# EAGLE design 16276 (EAGLE 7.6.0)
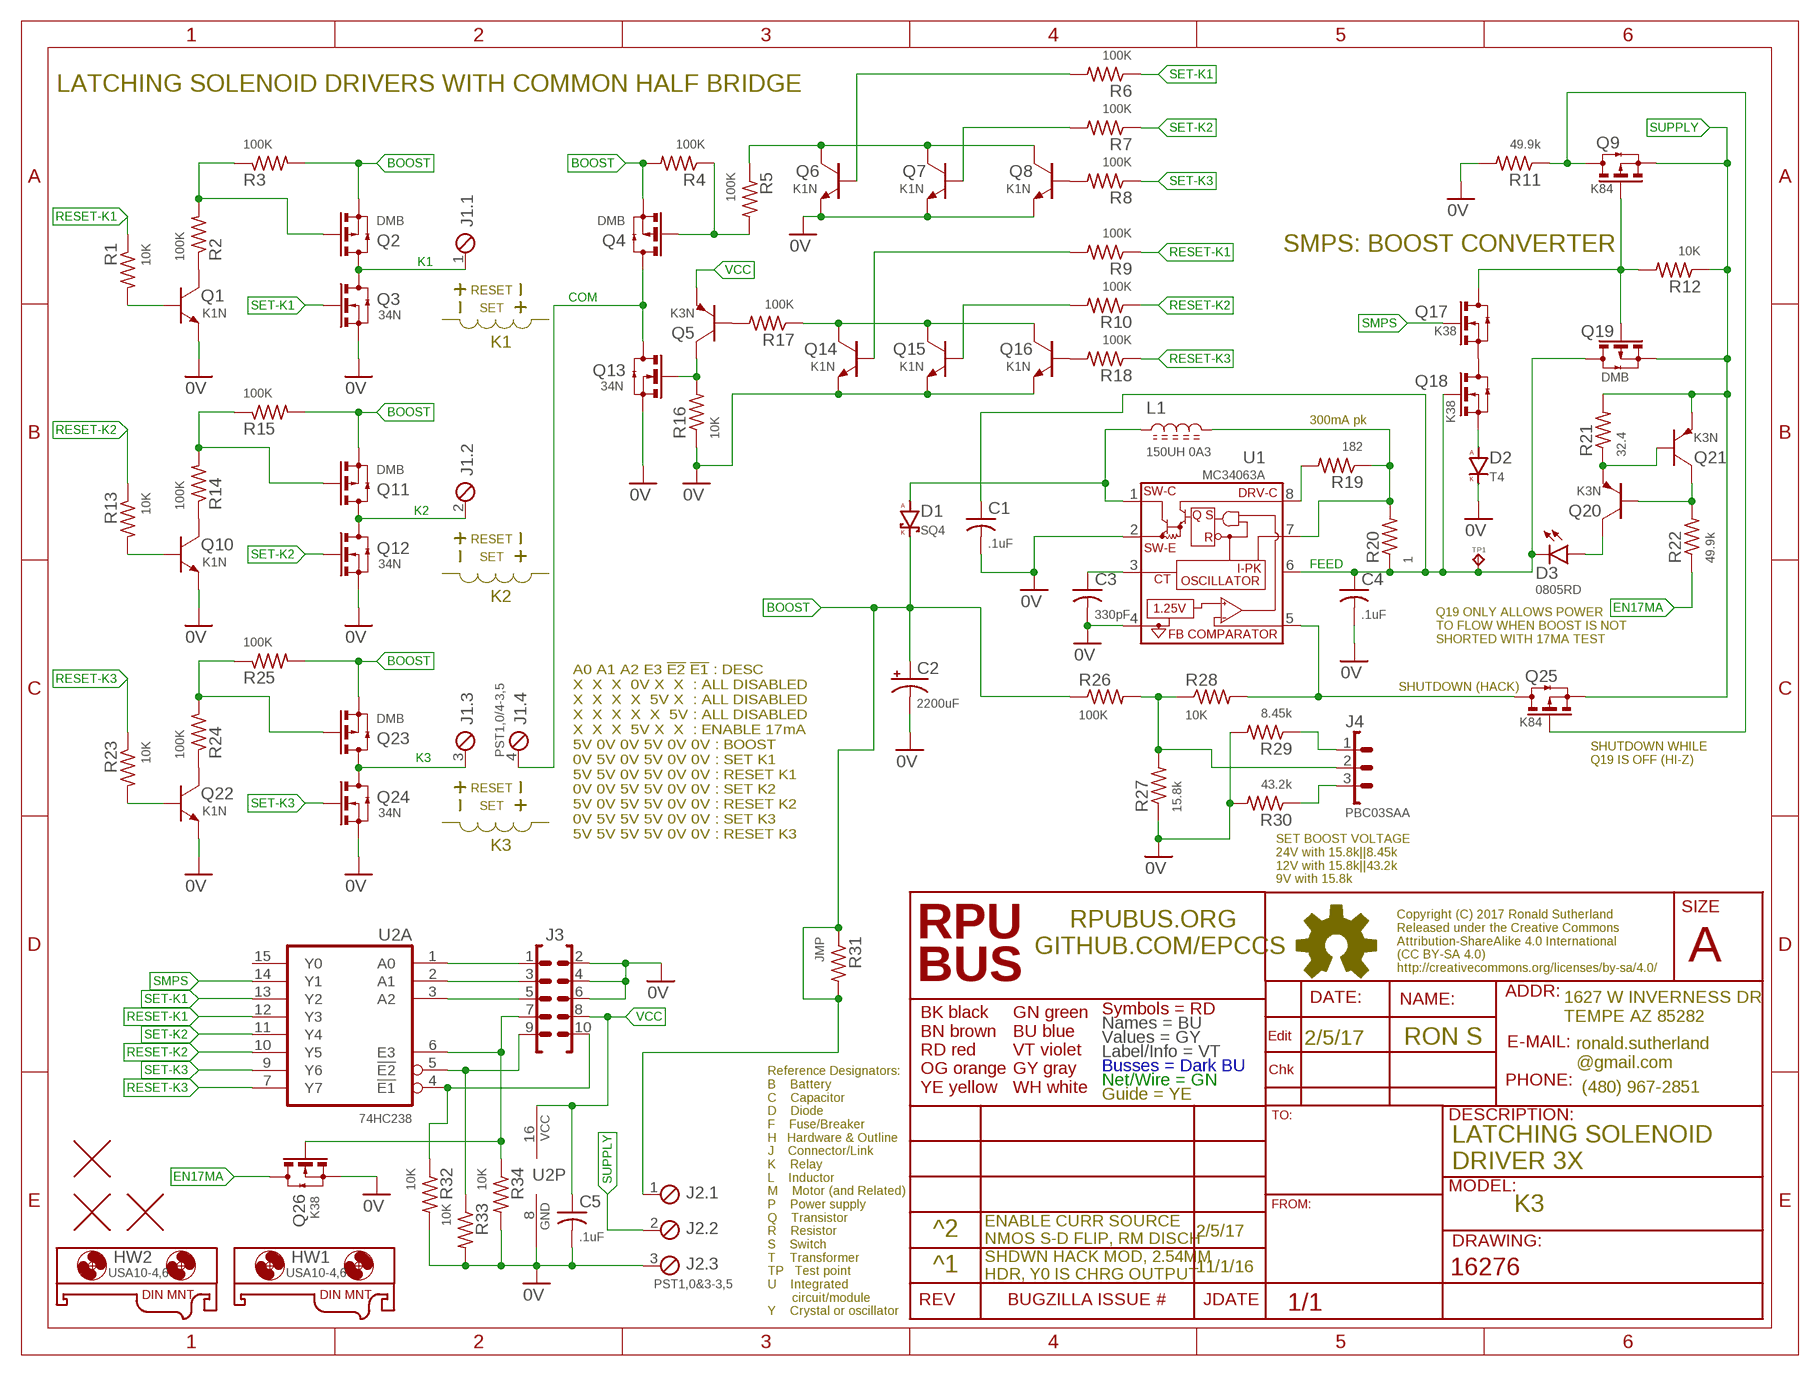
[diagram p0: schematic, sheet 1]

## Parts
C1  .1uF  CC0603A  [C0603(1608)]
C2  2200uF  C-AL7.5X18  [E7,5-18]
C3  330pF  CC0603A  [C0603(1608)]
C4  .1uF  CC0603A  [C0603(1608)]
C5  .1uF  CC0603A  [C0603(1608)]
D1  SQ4  DSMA  [SMA]
D2  T4  DSOD123  [SOD123]
D3  0805RD  LEDC0805(2012)  [C0805(2012)]
HW1  USA10-4,6  MOUNT-HOLE5.0  [USA10]
HW2  USA10-4,6  MOUNT-HOLE5.0  [USA10]
J1  PST1,0/4-3,5  MCV4  [MCV4]
J2  PST1,0&3-3,5  MCV3  [MCV3]
J3  2X5  [2X5]
J4  PBC03SAA  1X3  [1X3]
L1  150UH 0A3  L2626  [L2626]
Q1  K1N  NPNSOT23  [SOT23]
Q2  DMB  N-CHSOT23  [SOT23]
Q3  34N  N-CHSOT23  [SOT23]
Q4  DMB  N-CHSOT23  [SOT23]
Q5  K3N  PNPSOT23  [SOT23]
Q6  K1N  NPNSOT23  [SOT23]
Q7  K1N  NPNSOT23  [SOT23]
Q8  K1N  NPNSOT23  [SOT23]
Q9  K84  N-CHSOT23  [SOT23]
Q10  K1N  NPNSOT23  [SOT23]
Q11  DMB  N-CHSOT23  [SOT23]
Q12  34N  N-CHSOT23  [SOT23]
Q13  34N  N-CHSOT23  [SOT23]
Q14  K1N  NPNSOT23  [SOT23]
Q15  K1N  NPNSOT23  [SOT23]
Q16  K1N  NPNSOT23  [SOT23]
Q17  K38  N-CHSOT23  [SOT23]
Q18  K38  N-CHSOT23  [SOT23]
Q19  DMB  N-CHSOT23  [SOT23]
Q20  K3N  PNPSOT23  [SOT23]
Q21  K3N  PNPSOT23  [SOT23]
Q22  K1N  NPNSOT23  [SOT23]
Q23  DMB  N-CHSOT23  [SOT23]
Q24  34N  N-CHSOT23  [SOT23]
Q25  K84  N-CHSOT23  [SOT23]
Q26  K38  N-CHSOT23  [SOT23]
R1  10K  R0805  [C0805(2012)]
R2  100K  R0805  [C0805(2012)]
R3  100K  R0805  [C0805(2012)]
R4  100K  R0805  [C0805(2012)]
R5  100K  R0805  [C0805(2012)]
R6  100K  R0805  [C0805(2012)]
R7  100K  R0805  [C0805(2012)]
R8  100K  R0805  [C0805(2012)]
R9  100K  R0805  [C0805(2012)]
R10  100K  R0805  [C0805(2012)]
R11  49.9k  R0805  [C0805(2012)]
R12  10K  R0805  [C0805(2012)]
R13  10K  R0805  [C0805(2012)]
R14  100K  R0805  [C0805(2012)]
R15  100K  R0805  [C0805(2012)]
R16  10K  R0805  [C0805(2012)]
R17  100K  R0805  [C0805(2012)]
R18  100K  R0805  [C0805(2012)]
R19  182  R0805  [C0805(2012)]
R20  1  R1210  [C1210(3225)]
R21  32.4  R0805  [C0805(2012)]
R22  49.9k  R0805  [C0805(2012)]
R23  10K  R0805  [C0805(2012)]
R24  100K  R0805  [C0805(2012)]
R25  100K  R0805  [C0805(2012)]
R26  100K  R0805  [C0805(2012)]
R27  15.8k  R0805  [C0805(2012)]
R28  10K  R0805  [C0805(2012)]
R29  8.45k  R0805  [C0805(2012)]
R30  43.2k  R0805  [C0805(2012)]
R31  JMP  R0805  [C0805(2012)]
R32  10K  R0805  [C0805(2012)]
R33  10K  R0805  [C0805(2012)]
R34  10K  R0805  [C0805(2012)]
TP1  TPPAD1-08  [P1-08]
U1  MC34063A  [SOIC8]
U2  74HC238  74238D  [16SOIC]
U$2  FIDUCIAL1.27  [FIDUCIAL-1.27]
U$3  FIDUCIAL1.27  [FIDUCIAL-1.27]
U$4  FIDUCIAL1.27  [FIDUCIAL-1.27]

## Nets
0V: C1.2 C2.- C3.2 C4.2 C5.2 D2.C(K) J2.3 J3.2 J3.4 J3.6 Q1.E Q3.2(S)(S) Q6.E Q7.E Q8.E Q10.E Q12.2(S)(S) Q13.2(S)(S) Q14.E Q15.E Q16.E Q22.E Q24.2(S)(S) Q26.2(S)(S) R11.2 R16.1 R27.1 R29.2 R30.2 R32.2 R33.2 R34.2 U1.2(SW-E) U1.4(GND) U2.8(P:GND)
!E1: J3.10 R32.1 U2.4(A:!E1)
!E2: J3.9 R33.1 U2.5(A:!E2)
A0: J3.1 U2.1(A:A0)
A1: J3.3 U2.2(A:A1)
A2: J3.5 U2.3(A:A2)
BOOST: C2.+ D1.K J2.1 Q2.2(S)(S) Q4.2(S)(S) Q11.2(S)(S) Q23.2(S)(S) R3.2 R4.2 R15.2 R25.2 R26.1 R31.1 R31.2
COM: J1.4 Q4.3(D)(D) Q13.3(D)(D)
E3: J3.7 Q26.1(G)(G) R34.1 U2.6(A:E3)
EN17MA: Q26.3(D)(D) R22.1
FEED: C1.1 C4.1 D3.K Q18.1(G)(G) Q19.3(D)(D) R20.1 TP1.TP U1.6(VCC)
K1: J1.1 Q2.3(D)(D) Q3.3(D)(D)
K2: J1.2 Q11.3(D)(D) Q12.3(D)(D)
K3: J1.3 Q23.3(D)(D) Q24.3(D)(D)
N$2: Q9.3(D)(D) Q25.1(G)(G) R11.1
N$3: Q23.1(G)(G) R24.2 R25.1
N$4: Q22.C R24.1
N$5: Q22.B R23.2
N$6: Q17.2(S)(S) Q18.3(D)(D)
N$7: Q25.3(D)(D) R28.2 U1.5(FB)
N$8: D2.A Q18.2(S)(S)
N$9: Q4.1(G)(G) R4.1 R5.2
N$13: R19.2 U1.8(DRV-C)
N$14: L1.2 R19.1 R20.2 U1.7(I-PK)
N$15: D1.A L1.1 U1.1(SW-C)
N$16: C3.1 U1.3(CT)
N$21: Q5.C Q13.1(G)(G) R16.2
N$22: Q9.1(G)(G) Q17.3(D)(D) Q19.1(G)(G) R12.2
N$26: J4.2 R26.2 R27.2 R28.1
N$27: Q6.C Q7.C Q8.C R5.1
N$28: Q6.B R6.2
N$33: Q8.B R8.2
N$35: Q2.1(G)(G) R2.2 R3.1
N$36: Q1.C R2.1
N$37: Q1.B R1.2
N$43: Q11.1(G)(G) R14.2 R15.1
N$44: Q10.C R14.1
N$45: Q10.B R13.2
N$71: Q7.B R7.2
N$72: Q5.B R17.2
N$73: Q14.C Q15.C Q16.C R17.1
N$79: Q14.B R9.2
N$81: Q15.B R10.2
N$86: D3.A Q20.C
N$87: Q16.B R18.2
N$120: J4.3 R30.1
N$121: J4.1 R29.1
N$128: Q20.E Q21.B R21.1
N$132: Q20.B Q21.C R22.2
RESET-K1: R1.1 R9.1 U2.12(A:Y3)
RESET-K2: R10.1 R13.1 U2.10(A:Y5)
RESET-K3: R18.1 R23.1 U2.7(A:Y7)
SET-K1: Q3.1(G)(G) R6.1 U2.13(A:Y2)
SET-K2: Q12.1(G)(G) R7.1 U2.11(A:Y4)
SET-K3: Q24.1(G)(G) R8.1 U2.9(A:Y6)
SMPS: Q17.1(G)(G) U2.14(A:Y1)
SUPPLY: J2.2 Q9.2(S)(S) Q19.2(S)(S) Q21.E Q25.2(S)(S) R12.1 R21.2
VCC: C5.1 J3.8 Q5.E U2.16(P:VCC)
Unconnected: U2.15(A:Y0)

## Notes on the sheet
- LATCHING SOLENOID DRIVERS WITH COMMON HALF BRIDGE
- SMPS: BOOST CONVERTER
- RESET
- SET
- K1
- 300mA pk
- RESET
- SET
- K2
- Q19 ONLY ALLOWS POWER 
  TO FLOW WHEN BOOST IS NOT
  SHORTED WITH 17MA TEST
- SHUTDOWN (HACK)
- SHUTDOWN WHILE
  Q19 IS OFF (HI-Z)
- RESET
- SET
- A0 A1 A2 E3 !E2! !E1! : DESC
   X  X  X  0V X  X  : ALL DISABLED
   X  X  X  X  5V X  : ALL DISABLED
   X  X  X  X  X  5V : ALL DISABLED
   X  X  X  5V X  X  : ENABLE 17mA
   5V 0V 0V 5V 0V 0V : BOOST
   0V 5V 0V 5V 0V 0V : SET K1
   5V 5V 0V 5V 0V 0V : RESET K1
   0V 0V 5V 5V 0V 0V : SET K2
   5V 0V 5V 5V 0V 0V : RESET K2
   0V 5V 5V 5V 0V 0V : SET K3
   5V 5V 5V 5V 0V 0V : RESET K3
- K3
- SET BOOST VOLTAGE
  24V with 15.8k||8.45k
  12V with 15.8k||43.2k
  9V with 15.8k
- 2/5/17 | RON S
- LATCHING SOLENOID
  DRIVER 3X
- K3
- ^2 | 2/5/17
- ENABLE CURR SOURCE
  NMOS S-D FLIP, RM DISCH
- ^1 | 11/1/16
- SHDWN HACK MOD, 2.54MM 
  HDR, Y0 IS CHRG OUTPUT

## Library data of the parts
C1 C3-C5 = C-C:C: CAPACITOR Symbol
C2 = C-Al:C-AL: Aluminum Electrolytic Capacitors PW1J222 [NICHICON,UPW1J222MHD] CAP ALUM 63V 2200UF 20% RADIAL
D1 = D-SBR:D: DIODE
D2 = D-GP:D: DIODE
D3 = D-LED:LED: LED 120120WH [CREE,XHGAWT-00-0000-00000HXE1] LED WHITE 6500K 150LUM-W120120
HW1 HW2 = HW-DINMnt:MOUNT-HOLE: USA10-4.6 [PhxCont,1202713] DINRAIL ADAPTER UNIVERSAL 10MM 4.6MM
J1 = J-HDR3.5mm:MCV4: MCV 1,5/4-G-3,5-RN [PHOENIX CONTACT,1843622] CONN HEADER SHROUDED 2POS 3.5MM PST 1,0/4-3,5 [PHOENIX CONTACT,1945119] CONN HEADER STRIP PIN 4POS 3.5MM MCVR 1,5& 4-ST-3,5 [PHOENIX CONTACT,1863178] CONN PLUG 4POS SCREW 3.5MM
J2 = J-HDR3.5mm:MCV3: MCV 1,5/ 3-G-3,5-RN [PHOENIX CONTACT,1731484] CONN HEADER SHROUDED 3POS 3.5MM MCVR 1,5/ 3-ST-3,5 [PHOENIX CONTACT,1863165] CONN PLUG 3POS SCREW 3.5MM PST 1,0/3-3,5 [PHOENIX CONTACT,1945106] CONN HEADER STRIP PIN 3POS 3.5MM PT1,5&3-PVH-3,5 [PHOENIX CONTACT,1984028] CONN PLUG STRIP 3POS 3.5MM
J3 = J-HDR2.54mm:2X5: 2 X 5 POS HEADER
J4 = J-HDR2.54mm:1X3: 6 POS HEADER PBC03SAAN [SULLINS,PBC03SAAN]HEADER MALE BRKWAY 3POS .1IN AA
L1 = L-PWR:L: Inductor
Q1 Q6-Q8 Q10 Q14-Q16 Q22 = Q-NPN:NPN: BJT NPN General Purpose Amplifier
Q2 Q4 Q9 Q11 Q19 Q23 Q25 = Q-PCH:N-CH?*: ENHANCEMENT MODE MOSFET SOT23 is BSS138 pinout
Q3 Q12 Q13 Q17 Q18 Q24 Q26 = Q-NCH:N-CH?*: ENHANCEMENT MODE MOSFET SOT23 is BSS138 pinout
Q5 Q20 Q21 = Q-PNP:PNP: BJT NPN General Purpose Amplifier
R1-R34 = R-C:R: Resiistor American-style symbol
TP1 = J-TP:TP: Test pad
U1 = U-Boost:MC34063A
U2 = U-7400:74*238: non-Inverting Logic 3- to 8-Line Decoder/Demultiplexer see 74138 for Inverting
U$2-U$4 = H-Fiducial:FIDUCIAL: Fiducial Alignment Points Various fiducial points for machine vision alignment.

## Net classes
0 default: width 0.254 mm, drill 0.33 mm

## Board
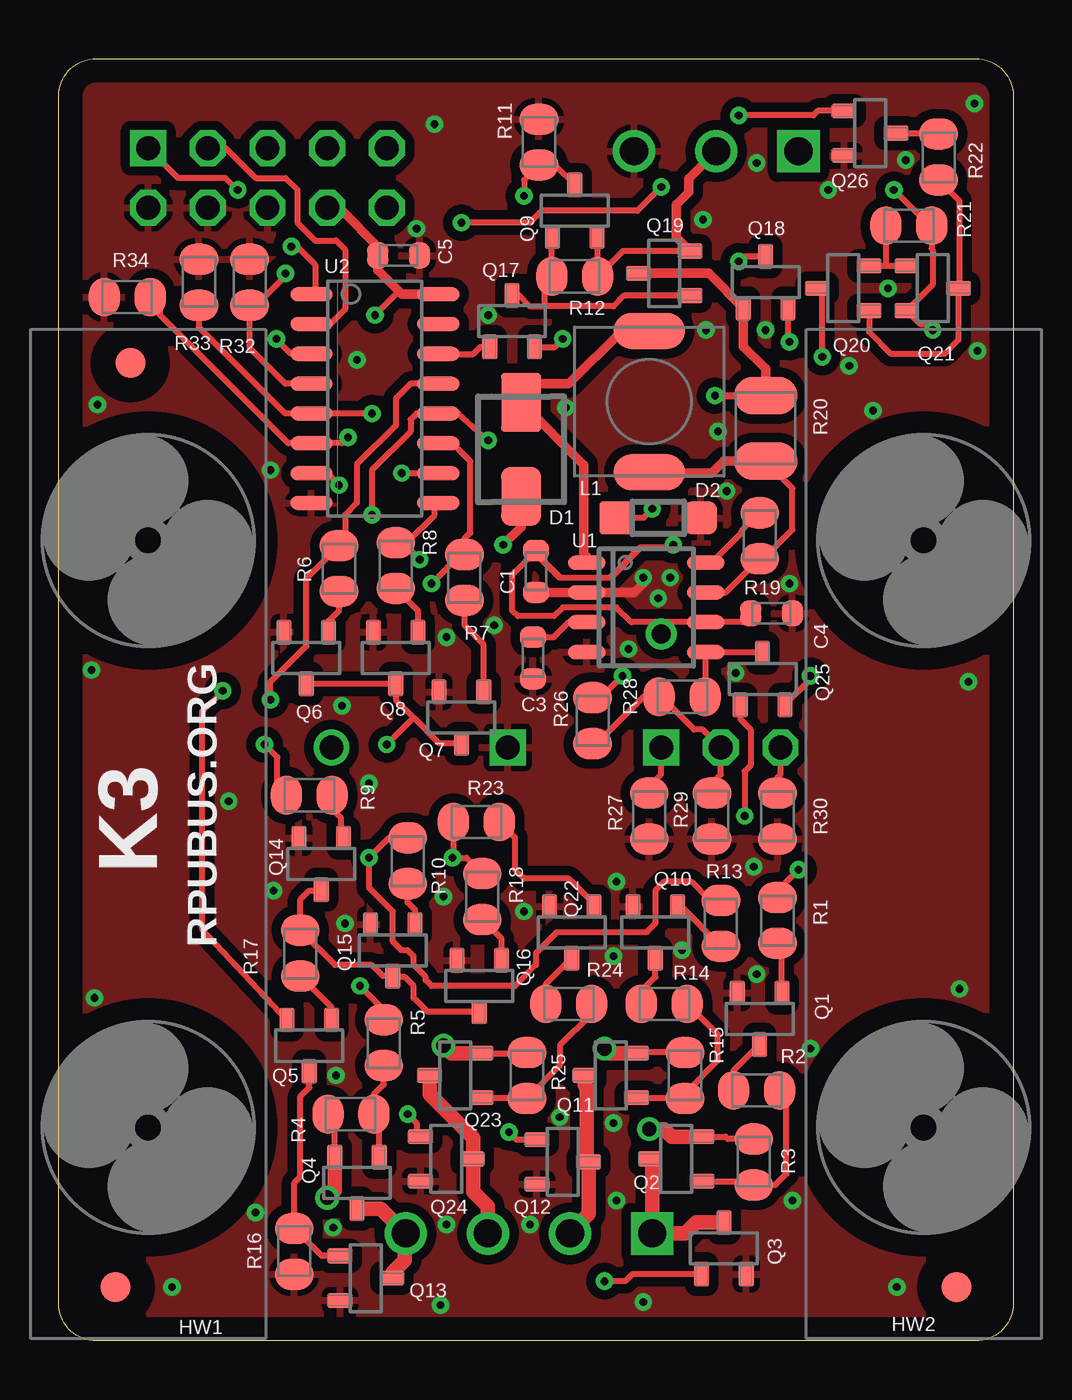
[diagram p1: board, top side]
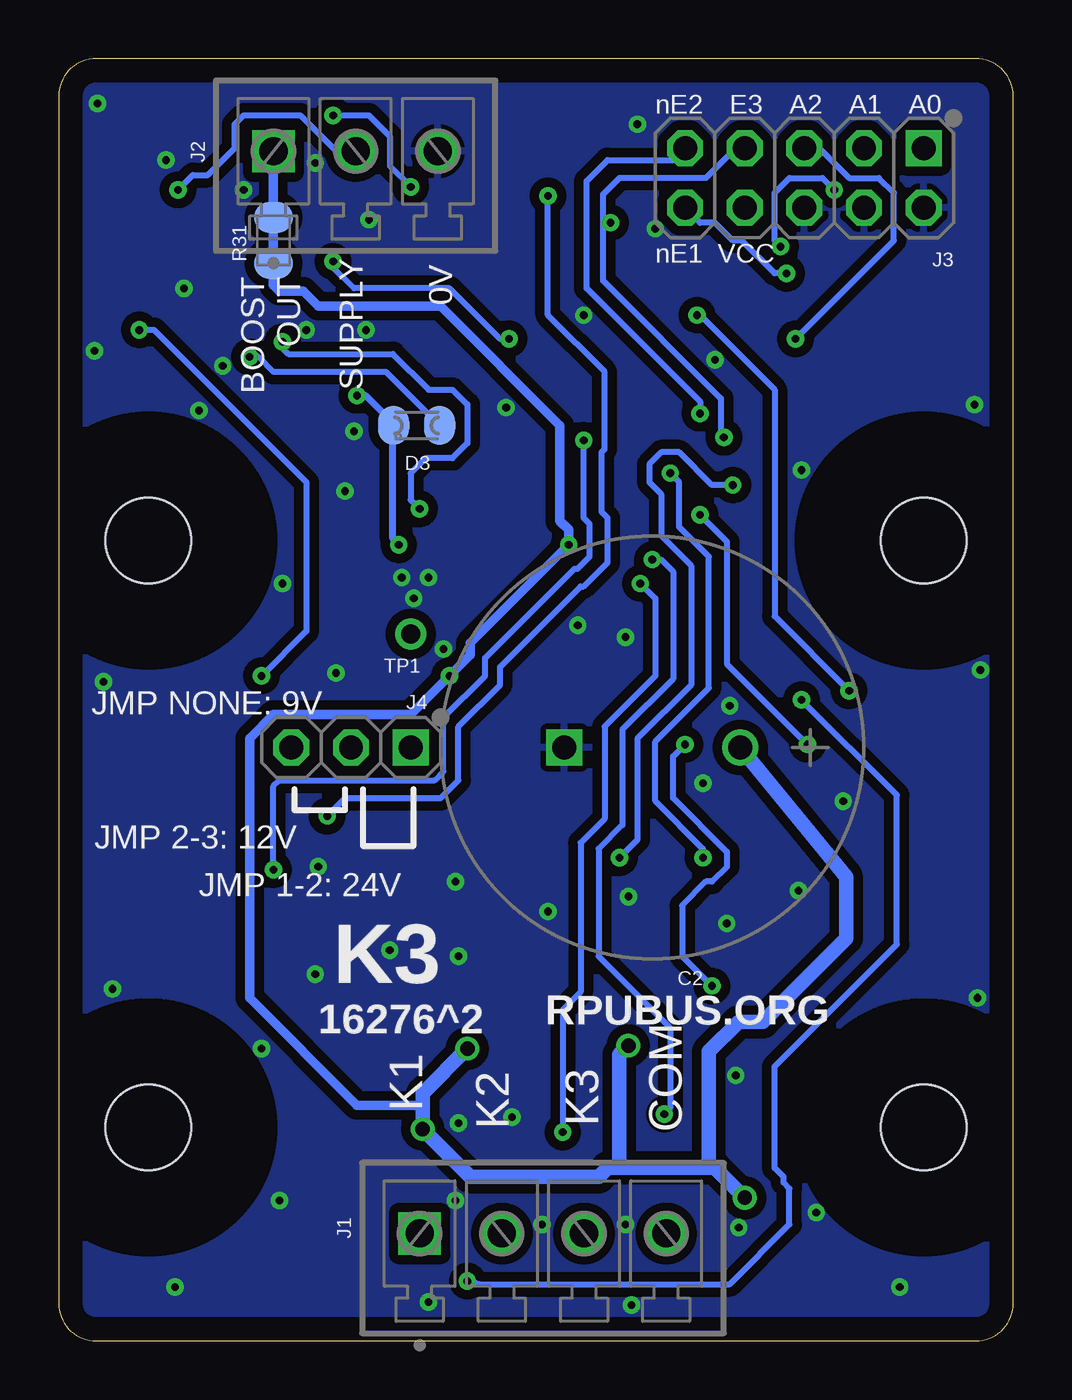
[diagram p2: board, bottom side, seen from below]

Size 40.64 x 54.61 mm. Coordinates in mm from the lower left corner, seen from the top.
Outline: 40.64,53.02 40.64,1.59 arc-90 39.05,0 1.59,0 arc-90 0,1.59 0,53.02 arc-90 1.59,54.61 39.05,54.61 arc-90 40.64,53.02
Copper layers (1*16): Top 0.034290625mm / dielectric 60mil / Bottom 0.034290625mm
Design rules "default *": minimum track width 10mil, minimum drill 13mil, track to track 12mil, track to pad 10mil, pad to pad 8mil, via to via 12mil, smd to smd 8mil, copper to edge 40mil, drill to drill 16mil, minimum pad ring 10mil, minimum via ring 8mil, stop-mask expansion 4mil, vias tented up to drill 17mil, thermal gap 10mil

### Footprints (pad centres in the part's own frame; a part is rotated, then mirrored left to right if it is on the bottom)
C0603(1608) = smd 0.898 x 1.1: 1 -0.889,0; 2 0.889,0
E7,5-18 = drill 1.016: + -3.75,0 | drill 1.016 square: - 3.75,0
SMA = smd 2.5 x 1.7: A 2,0; K -2,0
SOD123 = smd 1.4 x 1.4: A 1.8,0; C -1.8,0
C0805(2012) = smd 1.321 x 1.651: A 0.977,0; K -0.977,0
USA10 = hole 3.658: -12.5,0; 12.5,0
MCV4 = drill 1.2 square: 1 0,0 | drill 1.2: 2 3.5,0; 3 7,0; 4 10.5,0
MCV3 = drill 1.2 square: 1 0,0 | drill 1.2: 2 3.5,0; 3 7,0
2X5 = drill 1.016 square: 1 0,0 | drill 1.016 octagon: 2 0,2.54; 3 2.54,0; 4 2.54,2.54; 5 5.08,0; 6 5.08,2.54; 7 7.62,0; 8 7.62,2.54; 9 10.16,0; 10 10.16,2.54
1X3 = drill 1.016 square: 1 0,0 | drill 1.016 octagon: 2 2.54,0; 3 5.08,0
L2626 = smd 1.524 x 3.048: 1 3.01,0; 2 -3.01,0
SOT23 = smd 0.65 x 1.06: B -0.95,-1.1; C 0,1.1; E 0.95,-1.1
SOT23' = smd 0.65 x 1.06: 1(G) -0.95,-1.1; 2(S) 0.95,-1.1; 3(D) 0,1.1
C0805(2012)' = smd 1.321 x 1.651: 1 -0.977,0; 2 0.977,0
C1210(3225) = smd 1.6 x 2.7: 1 -1.4,0; 2 1.4,0
P1-08 = drill 0.813: TP 0,0
SOIC8 = smd 0.6 x 1.6: 1 -1.905,-2.54; 2 -0.635,-2.54; 3 0.635,-2.54; 4 1.905,-2.54; 5 1.905,2.54; 6 0.635,2.54; 7 -0.635,2.54; 8 -1.905,2.54
16SOIC = smd 0.6 x 1.8: 1 -4.445,-2.7; 2 -3.175,-2.7; 3 -1.905,-2.7; 4 -0.635,-2.7; 5 0.635,-2.7; 6 1.905,-2.7; 7 3.175,-2.7; 8 4.445,-2.7; 9 4.445,2.7; 10 3.175,2.7; 11 1.905,2.7; 12 0.635,2.7; 13 -0.635,2.7; 14 -1.905,2.7; 15 -3.175,2.7; 16 -4.445,2.7
FIDUCIAL-1.27 = smd 1.27 x 1.27: 1 0,0

### Placement (x,y rotation side)
C1  20.32,32.77 270 top
C2  15.37,25.27 180 bottom
C3  20.19,29.08 270 top
C4  30.35,30.99 0 top
C5  14.48,46.23 0 top
D1  19.68,37.97 90 top
D2  25.53,35.05 180 top
D3  25.4,38.99 0 bottom
HW1  3.81,21.59 90 top
HW2  36.83,21.59 90 top
J1  25.27,4.57 0 bottom
J2  31.5,50.67 0 bottom
J3  3.81,50.8 180 bottom
J4  25.65,25.27 180 bottom
L1  25.15,40.01 90 top
Q1  29.84,13.72 180 top
Q2  DMB  [SOT23']  26.29,7.75 90 top
Q3  34N  [SOT23']  28.32,3.94 0 top
Q4  DMB  [SOT23']  12.7,6.73 180 top
Q5  10.67,12.57 180 top
Q6  10.54,29.08 180 top
Q7  17.14,26.54 180 top
Q8  14.35,29.08 180 top
Q9  K84  [SOT23']  21.97,48.13 0 top
Q10  25.4,17.4 180 top
Q11  DMB  [SOT23']  23.5,11.3 90 top
Q12  34N  [SOT23']  21.46,7.62 270 top
Q13  34N  [SOT23']  13.08,2.67 270 top
Q14  11.18,20.32 180 top
Q15  14.22,16.64 180 top
Q16  17.91,15.11 180 top
Q17  K38  [SOT23']  19.3,43.43 0 top
Q18  K38  [SOT23']  30.1,45.09 0 top
Q19  DMB  [SOT23']  25.78,45.47 90 top
Q20  33.4,44.83 90 top
Q21  37.21,44.83 270 top
Q22  21.84,17.4 180 top
Q23  DMB  [SOT23']  16.89,11.3 90 top
Q24  34N  [SOT23']  16.51,7.75 270 top
Q25  K84  [SOT23']  29.97,28.19 0 top
Q26  K38  [SOT23']  34.54,51.44 270 top
R1  10K  [C0805(2012)']  30.61,17.91 270 top
R2  100K  [C0805(2012)']  29.72,10.67 0 top
R3  100K  [C0805(2012)']  29.59,7.62 90 top
R4  100K  [C0805(2012)']  12.45,9.65 180 top
R5  100K  [C0805(2012)']  13.84,12.7 270 top
R6  100K  [C0805(2012)']  11.94,32.89 270 top
R7  100K  [C0805(2012)']  17.27,32.51 270 top
R8  100K  [C0805(2012)']  14.35,33.02 270 top
R9  100K  [C0805(2012)']  10.67,23.24 0 top
R10  100K  [C0805(2012)']  14.86,20.45 270 top
R11  49.9k  [C0805(2012)']  20.45,51.05 90 top
R12  10K  [C0805(2012)']  21.97,45.34 180 top
R13  10K  [C0805(2012)']  28.19,17.78 270 top
R14  100K  [C0805(2012)']  25.78,14.35 0 top
R15  100K  [C0805(2012)']  26.67,11.3 90 top
R16  10K  [C0805(2012)']  10.03,3.81 90 top
R17  100K  [C0805(2012)']  10.29,16.51 270 top
R18  100K  [C0805(2012)']  18.03,18.92 270 top
R19  182  [C0805(2012)']  29.84,34.29 90 top
R20  30.1,38.86 270 top
R21  32.4  [C0805(2012)']  36.2,47.5 0 top
R22  49.9k  [C0805(2012)']  37.47,50.42 270 top
R23  10K  [C0805(2012)']  17.78,22.1 0 top
R24  100K  [C0805(2012)']  21.72,14.35 0 top
R25  100K  [C0805(2012)']  19.94,11.3 90 top
R26  100K  [C0805(2012)']  22.73,26.42 270 top
R27  15.8k  [C0805(2012)']  27.81,22.35 90 top
R28  10K  [C0805(2012)']  26.54,27.43 0 top
R29  8.45k  [C0805(2012)']  25.15,22.35 270 top
R30  43.2k  [C0805(2012)']  30.61,22.35 270 top
R31  JMP  [C0805(2012)']  31.5,46.86 90 bottom
R32  10K  [C0805(2012)']  8.13,45.09 90 top
R33  10K  [C0805(2012)']  5.97,45.09 90 top
R34  10K  [C0805(2012)']  2.92,44.45 180 top
TP1  25.65,30.1 0 bottom
U1  25.02,31.24 270 top
U2  13.46,40.13 270 top
U$2  38.23,2.29 0 top
U$3  3.05,41.66 0 top
U$4  2.41,2.29 0 top

### Tracks (layer width: path | path; a pad name or v marks a point on that pad's centre or on a via)
0V  (via drill 0.33)
  Top 0.406: C1.2 U1.2 24.51,31.88 24.89,32.26
  other vias: 24.89,32.51 26.04,32.51 25.53,31.62 28.45,36.2 24.26,29.46 23.75,19.56 31.11,32.26 34.67,39.62 39.12,42.16 38.99,52.7 16,51.82 1.65,39.88 9.02,37.08 1.4,28.57 13.21,23.75 1.52,14.61 8.38,5.46 4.83,2.29 24.89,1.65 35.69,2.29 38.35,14.99 16.38,18.92 12.19,17.78 19.81,18.29 7.24,22.99 11.68,4.83 20.07,4.95 23.75,5.97 23.62,9.27 21.34,9.53 16.51,4.95 16.26,1.52 9.14,19.18 15.24,47.37 21.59,39.75 28.07,38.73 27.56,43.05 27.43,47.75 33.66,41.53 12.7,41.78 38.73,28.07 26.54,16.64 23.62,16.38 18.29,43.69 30.1,43.05 29.72,50.16 32.77,49.02 36.07,50.29 35.31,44.83 29.59,20.19 32,12.45 29.72,15.62 31.24,5.97 11.81,11.3 12.06,27.05 28.83,28.45 18.54,30.48 16.51,29.97
  pour Bottom (isolate 0.406): 0,54.61 40.64,54.61 40.64,0 0,0
  pour Top (isolate 0.406, rank 6): 0,54.61 40.64,54.61 40.64,0 0,0
!E1  (via drill 0.33)
  Top 0.254: U2.4 9.65,40.77 8.13,42.29 R32.1 8.42,44.11 9.65,45.34 v9.65,45.47
  Bottom 0.254: v9.65,45.47 10.16,45.47 11.56,46.86 11.94,46.86 12.7,47.62 13.34,47.62 J3.10
!E2  (via drill 0.33)
  Top 0.254: v13.34,39.5 U2.5 9.65,39.5 5.97,43.18 R33.1
  Bottom 0.254: v13.34,39.5 13.34,40.01 18.16,44.83 18.16,49.4 17.27,50.29 14.48,50.29 J3.9
A0  (via drill 0.33)
  Top 0.254: v9.91,46.61 10.16,46.61 10.92,45.85 10.92,44.74 U2.1 | v7.62,49.02 7.11,49.53 5.08,49.53 J3.1
  Bottom 0.254: v9.91,46.61 10.16,46.86 10.16,48.9 9.53,49.53 8.13,49.53 v7.62,49.02
A1
  Top 0.254: U2.2 11.56,43.31 12.19,43.94 12.19,46.48 11.81,46.86 10.92,46.86 10.16,47.62 10.16,49.02 9.65,49.53 8.38,49.53 7.11,50.8 J3.3
A2  (via drill 0.33)
  Top 0.254: U2.3 9.91,42.04 v9.27,42.67
  Bottom 0.254: v9.27,42.67 5.08,46.86 5.08,48.9 5.71,49.53 6.99,49.53 8.26,50.8 J3.5
BOOST  (via drill 0.33, 0.61)
  Top 0.254: Q4.2(S) 11.75,9.33 11.68,9.4 11.62,9.62 R4.2 | R26.1 23.07,27.39 v24,28.32 | R15.2 24.62,12.28 Q11.2(S) | Q23.2(S) 19.91,12.25 R25.2 | R3.2 28.49,8.6 28.39,8.7 Q2.2(S)
  Top 0.406: D1.K 19.68,34.67 v18.92,33.91
  Top 0.61: v25.15,9.02 25.78,9.02 26.1,8.7 Q2.2(S) | Q11.2(S) 23.43,12.25 v23.24,12.45 | Q23.2(S) 16.7,12.25 v16.38,12.57 | Q4.2(S) 11.75,6.42 v11.43,6.1
  Bottom 0.406: 25.15,10.03 27.94,10.03 32.51,14.61 32.51,25.65 31.5,26.67 25.65,26.67 v24,28.32 23.11,29.21 23.11,29.72 v18.92,33.91 18.92,34.54 19.3,34.92 19.3,38.99 24.38,44.07 29.59,44.07 30.23,44.7 31.24,44.7 31.5,44.96 R31.1 R31.2 J2.1
  Bottom 0.61: v11.43,6.1 12.7,7.37 12.95,7.37 | 12.95,7.37 16.76,7.37 | 16.76,7.37 17.27,7.37 17.65,6.99 23.11,6.99 v25.15,9.02 25.15,10.03 25.15,10.54 v23.24,12.45 | C2.+ 7.11,19.75 7.11,17.14 10.67,13.59 11.68,13.59 12.95,12.32 12.95,7.37 | v16.38,12.57 16.76,12.19 16.76,7.37
COM
  Top 0.61: Q13.3(D) 14.22,2.92 14.73,3.43 14.73,4.53 J1.4 13.71,5.63 Q4.3(D)
E3  (via drill 0.33)
  Top 0.254: v12.32,38.48 12.06,38.23 U2.6 9.78,38.23 4.32,43.69 4.32,44.03 R34.1 | v25.65,49.15 24.64,48.13 20.57,48.13 20.07,47.62 v17.14,47.62 | Q26.1(G) 32.32,52.38 32.13,52.2 v28.96,52.2
  Bottom 0.254: v12.32,38.48 12.45,38.61 12.45,40.13 17.46,45.15 17.46,47.62 | J3.7 11.81,50.8 13.08,49.53 16.76,49.53 17.46,48.83 17.46,47.62 | v17.14,47.62 17.46,47.62 | v28.96,52.2 27.43,52.2 26.54,51.31 26.54,50.04 v25.65,49.15
EN17MA
  Top 0.254: Q26.3(D) 37.43,51.44 R22.1
FEED  (via drill 0.33)
  Top 0.254: C4.1 29.08,30.61 U1.6 25.78,30.61 | 25.78,30.61 24.38,30.61 23.75,31.24 21.46,31.24 21.08,30.86 19.56,30.86 19.3,31.11 19.3,32.64 C1.1 20.32,33.53 | 21.34,32.51 23.5,32.51 | 26.04,33.78 v26.16,33.91 | R20.1 | TP1.TP 25.65,30.48 25.78,30.61
  Top 0.305: 20.32,33.53 21.34,32.51 | 23.5,32.51 24.77,33.78 26.04,33.78 | v27.94,40.26 R20.1
  Top 0.406: Q19.3(D) 27.67,45.47 Q18.1(G) 29.15,42.35 30.1,41.4 R20.1
  Bottom 0.254: 26.42,38.95 D3.K 26.38,39.08
  Bottom 0.305: v26.16,33.91 26.42,34.16 26.42,38.95 | 26.38,39.08 27.56,40.26 v27.94,40.26
K1
  Top 0.61: Q2.3(D) 25.27,7.66 J1.1 26.67,4.57 27.14,5.04 Q3.3(D)
K2
  Top 0.61: Q11.3(D) 22.39,10.88 22.48,10.79 22.48,7.87 22.52,7.79 Q12.3(D) 22.56,5.42 21.77,4.63 J1.2
K3
  Top 0.61: Q23.3(D) 15.79,10.5 17.65,8.64 17.65,7.54 Q24.3(D) 17.65,7.45 17.65,6.35 18.27,5.73 J1.3
N$2  (via drill 0.33)
  Top 0.254: Q9.3(D) 21.13,50.08 R11.1 19.81,49.44 v19.81,48.77 | Q25.1(G) 29.02,26.48 29.46,26.04 29.46,24.51 29.21,24.26 v29.21,22.35
  Bottom 0.254: v29.21,22.35 28.45,23.11 24.38,23.11 23.62,23.88 23.62,26.16 21.84,27.94 21.84,28.7 18.41,32.13 18.29,32.13 17.27,33.15 17.27,35.05 17.53,35.31 17.53,37.85 17.4,37.97 17.4,41.27 19.81,43.69 v19.81,48.77
N$3
  Top 0.254: R24.2 22.69,13.93 21.34,12.57 21.34,11.72 R25.1 18.02,10.33 Q23.1(G)
N$4
  Top 0.254: R24.1 20.74,15.2 Q22.C
N$5
  Top 0.254: Q22.B 22.79,18.61 21.72,19.68 19.81,19.68 19.43,20.07 19.43,21.42 R23.2
N$6  (via drill 0.33)
  Top 0.254: Q17.2(S) 21.12,42.33 v21.46,42.67 | Q18.3(D) 29.17,46.19 v28.96,45.97
  Bottom 0.254: v21.46,42.67 21.84,42.67 24,44.83 28.07,44.83 28.96,45.72 v28.96,45.97
N$7
  Top 0.254: R28.2 27.52,27.65 27.56,27.81 U1.5 29.8,29.34 Q25.3(D)
N$8  (via drill 0.33)
  Top 0.254: v25.27,35.43 24.89,35.05 D2.A | Q18.2(S) 31.05,42.61 v31.11,42.55
  Bottom 0.254: v31.11,42.55 31.11,42.29 30.86,42.04 26.42,42.04 24.89,40.51 23.88,40.51 23.24,39.88 23.24,38.23 23.88,37.59 25.02,37.59 25.65,36.96 25.65,35.81 v25.27,35.43
N$9
  Top 0.254: Q4.1(G) 13.65,9.21 13.59,9.27 13.52,9.62 R4.1 13.42,10.5 13.84,10.92 R5.2
N$13
  Top 0.254: U1.8 27.81,33.15 29.08,34.42 29.08,34.51 R19.2
N$14
  Top 0.254: U1.7 28.41,31.88 R19.1 30.01,33.31 31.24,34.54 31.24,36.32 R20.2
  Top 0.406: R20.2 28.32,37.46 27.81,36.96 25.18,36.96 L1.2
N$15
  Top 0.406: L1.1 23.96,43.02 21.72,40.77 20.48,40.77 D1.A 22.35,37.31 22.35,33.53 22.48,33.4 U1.1
N$16
  Top 0.254: C3.1 21.08,29.97 21.72,30.61 U1.3
N$21
  Top 0.254: Q13.1(G) 11.2,3.62 R16.2 10.03,6.73 10.29,6.99 10.29,10.41 10.67,10.79 Q5.C
N$22
  Top 0.254: 20.7,44.07 20.7,45.05 R12.2 20.99,47.01 Q9.1(G) | Q19.1(G) 24.07,44.52 23.62,44.07 20.7,44.07 | Q17.3(D) 19.6,44.53 20.07,44.07 20.7,44.07
N$26
  Top 0.254: R26.2 22.9,25.44 24.89,27.43 R28.1 25.57,27.18 25.91,27.18 27.05,26.04 27.43,26.04 J4.2 28.19,24.13 27.81,23.75 R27.2
N$27  (via drill 0.33)
  Top 0.254: Q7.C 16.21,25.44 15.11,26.54 | 15.11,26.54 14.35,27.3 Q8.C Q6.C | v13.97,25.4 15.11,26.54 | R5.1 13.84,14.1 v12.83,15.11
  Bottom 0.254: v13.97,25.4 14.48,24.89 14.48,23.11 12.19,20.83 12.19,20.19 12.83,19.56 13.08,19.56 14.1,18.54 14.1,16.38 v12.83,15.11
N$28
  Top 0.254: Q6.B 11.49,30.67 11.94,31.11 R6.2
N$33
  Top 0.254: Q8.B 15.3,31.09 R8.2
N$35
  Top 0.254: Q2.1(G) 29.44,6.8 R3.1 30.52,6.64 30.99,7.11 30.99,10.38 R2.2
N$36
  Top 0.254: R2.1 28.74,11.51 Q1.C
N$37
  Top 0.254: Q1.B 30.8,16.74 R1.2
N$43
  Top 0.254: Q11.1(G) 26.64,10.35 R15.1 26.67,10.54 28.07,11.94 28.07,13.04 R14.2
N$44
  Top 0.254: R14.1 24.8,14.9 25.4,15.49 Q10.C
N$45
  Top 0.254: Q10.B 26.5,18.5 R13.2
N$71
  Top 0.254: Q7.B 18.09,29.66 17.27,30.48 R7.2
N$72
  Top 0.254: Q5.B 11.62,14.2 R17.2
N$73
  Top 0.254: Q16.C 15.71,14.01 15.11,14.61 15.11,15.11 14.73,15.49 14.27,15.49 Q15.C 13.8,15.54 13.34,16 11.77,16 R17.1 10.29,18.8 10.67,19.18 11.13,19.18 Q14.C
N$79
  Top 0.254: Q14.B 12.02,21.42 12.02,22.27 11.68,22.61 R9.2
N$81
  Top 0.254: Q15.B 15.17,18.35 14.86,18.67 R10.2
N$86  (via drill 0.33)
  Top 0.254: v32.51,41.91 32.51,44.62 Q20.C
  Bottom 0.254: D3.A 26.71,41.27 31.5,41.27 32.13,41.91 v32.51,41.91
N$87
  Top 0.254: Q16.B 18.86,17.12 R18.2
N$120
  Top 0.254: R30.1 30.61,24 30.73,24.13 J4.3
N$121
  Top 0.254: R29.1 25.15,23.62 25.65,24.13 J4.1
N$128
  Top 0.254: Q21.B 35.18,45.78 | 35.18,45.78 Q20.E | R21.1 35.22,45.82 35.18,45.78
N$132
  Top 0.254: Q20.B 34.5,42.97 35.43,42.04 37.72,42.04 38.31,42.63 Q21.C 38.35,44.87 38.35,48.55 R22.2
RESET-K1  (via drill 0.33)
  Top 0.254: v13.34,35.18 13.34,37.08 14.99,38.73 14.99,39.24 15.24,39.5 U2.12 17.02,39.5 v18.29,38.35 | 8.89,25.27 v8.76,25.4 9.31,24.85 9.31,23.71 9.65,23.37 R9.1 | R1.1 30.61,19.18 v31.5,20.07
  Bottom 0.254: v13.34,35.18 12.19,34.04 12.19,28.83 v8.76,25.4 | v18.29,38.35 18.29,35.05 18.03,34.8 18.03,33.4 18.54,32.89 18.67,32.89 22.48,29.08 22.48,28.32 24.26,26.54 24.26,24.26 24.64,23.88 31.24,23.88 31.5,23.62 v31.5,20.07
RESET-K2  (via drill 0.33)
  Top 0.254: R10.1 14.06,21.42 v13.21,20.57 13.21,19.3 14.22,18.29 14.22,17.02 14.61,16.64 14.86,16.64 15.11,16.38 15.11,16 15.62,15.49 15.62,15.37 15.88,15.11 19.43,15.11 20.32,16 20.32,16.51 21.21,17.4 25.02,17.4 25.4,17.78 25.4,19.18 25.78,19.56 26.92,19.56 27.73,18.76 R13.1 | v14.61,36.96 U2.10
  Bottom 0.254: v13.21,20.57 13.21,20.95 15.24,22.99 15.24,25.53 12.95,27.81 12.95,33.4 14.22,34.67 14.22,36.58 v14.61,36.96
RESET-K3  (via drill 0.33)
  Top 0.254: U2.7 11.43,36.96 v11.94,36.45 | R18.1 17.36,20.57 v16.76,20.57 16.8,20.61 R23.1
  Bottom 0.254: v11.94,36.45 12.83,36.45 14.22,37.85 14.99,37.85 15.49,37.34 15.49,36.58 14.99,36.07 14.99,34.29 13.72,33.02 13.72,27.94 16,25.65 16,21.34 v16.76,20.57
SET-K1  (via drill 0.33)
  Top 0.254: U2.13 14.99,40.77 14.35,40.13 14.35,38.99 12.7,37.34 12.7,35.69 12.19,35.18 12.19,34.12 R6.1 10.54,32.47 10.54,29.59 9.02,28.07 v9.02,27.3 | Q3.1(G) 24.43,2.84 24.13,2.54 v23.24,2.54
  Bottom 0.254: v23.24,2.54 22.99,2.54 22.73,2.41 12.06,2.41 9.53,4.95 9.53,6.48 9.78,6.73 9.78,6.99 10.16,7.37 10.16,11.68 4.95,16.89 4.95,23.24 v9.02,27.3
SET-K2  (via drill 0.33)
  Top 0.254: U2.11 16.76,38.23 17.53,37.47 17.53,34.42 17.27,34.16 R7.1 17.11,33.49 v15.88,32.26 | 19.43,8.64 v19.18,8.89 19.5,8.57 Q12.1(G)
  Bottom 0.254: v15.88,32.26 15.24,31.62 15.24,28.32 17.4,26.16 17.4,22.23 18.41,21.21 18.41,14.86 19.18,14.1 v19.18,8.89
SET-K3  (via drill 0.33)
  Top 0.254: R8.1 14.82,34 | 14.82,34 16,35.18 16,35.53 U2.9 | 14.82,34 14.82,33.82 v15.37,33.27 | v14.86,9.65 15.24,9.27 15.24,8.87 Q24.1(G)
  Bottom 0.254: v15.37,33.27 14.99,33.27 14.48,32.77 14.48,28.19 16.64,26.04 16.64,21.97 17.65,20.95 17.65,16.38 14.61,13.34 14.61,9.91 v14.86,9.65
SMPS
  Top 0.254: U2.14 17.65,42.04 17.95,42.33 Q17.1(G)
SUPPLY  (via drill 0.33)
  Top 0.254: v32,28.32 32,28.18 Q25.2(S) | Q9.2(S) 22.95,47.01 R12.1 24.02,46.42 Q19.2(S) | v37.21,43.05 36.96,43.31 36.69,43.31 Q21.E 37.21,44.98 37.21,46.48 37.17,46.52 R21.2 37.08,47.5 v35.56,49.02
  Top 0.406: J2.2 26.82,49.5 26.82,48.92 26.29,48.39 26.29,47.01 Q19.2(S)
  Bottom 0.254: v32,28.32 30.1,30.23 30.1,36.58 36.58,43.05 v37.21,43.05 | v35.56,49.02 34.92,49.66 34.29,49.66 33.15,50.8 33.15,51.82 32.77,52.2 30.35,52.2 28.83,50.67 J2.2
VCC  (via drill 0.33)
  Top 0.254: 14.61,44.58 14.35,44.58 v13.46,43.69 | v6.99,27.69 6.1,26.8 6.1,17.55 Q5.E
  Top 0.406: J3.8 11.94,48.26 13.72,46.48 C5.1 13.59,45.59 14.61,44.58 U2.16
  Bottom 0.254: v13.46,43.69 13.34,43.69 10.16,40.51 10.16,30.86 v6.99,27.69

### Text on the board
tPlace: K3 | RPUBUS.ORG
bPlace: A0 | A1 | A2 | E3 | nE2 | VCC | nE1 | 0V | SUPPLY | BOOST / OUT | JMP NONE: 9V | JMP 2-3: 12V | JMP 1-2: 24V | K3 | RPUBUS.ORG | 16276^2 | K1 | COM | K3 | K2